# EAGLE schematic module xbee- Schema electrique (EAGLE 9.5.1)
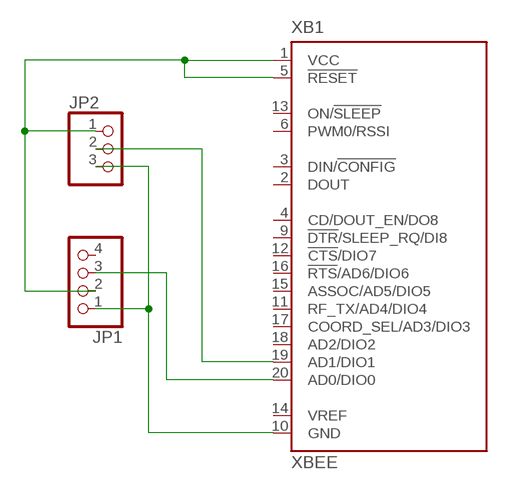
[diagram p0: schematic, sheet 1]

## Parts
JP1  PINHD-1X4  [1X04]
JP2  PINHD-1X3  [1X03]
XB1  XBEE  [XBEE]

## Nets
N$1: JP1.2 JP2.1 XB1.1(VCC) XB1.5(!RESET)
N$2: JP1.1 JP2.3 XB1.10(GND)
N$3: JP1.3 XB1.20(AD0/DIO0)
N$4: JP2.2 XB1.19(AD1/DIO1)
Unconnected: JP1.4 XB1.2(DOUT) XB1.3(DIN/!CONFIG) XB1.4(CD/DOUT_EN/DO8) XB1.6(PWM0/RSSI) XB1.9(!DTR!/SLEEP_RQ/DI8) XB1.11(RF_TX/AD4/DIO4) XB1.12(!CTS!/DIO7) XB1.13(ON/!SLEEP) XB1.14(VREF) XB1.15(ASSOC/AD5/DIO5) XB1.16(!RTS!/AD6/DIO6) XB1.17(COORD_SEL/AD3/DIO3) XB1.18(AD2/DIO2)

## Library data of the parts
JP1 = pinhead:PINHD-1X4: PIN HEADER
JP2 = pinhead:PINHD-1X3: PIN HEADER
XB1 = maxstream:XBEE: XBee (TM) /XBee-PRO(TM) OEM RF Modules Source: MaxStream, Inc. xbee_productmanual.pdf; MPN: XBP24-Z7UIT-004; OC_FARNELL: 1751799; OC_NEWARK: 34R5507